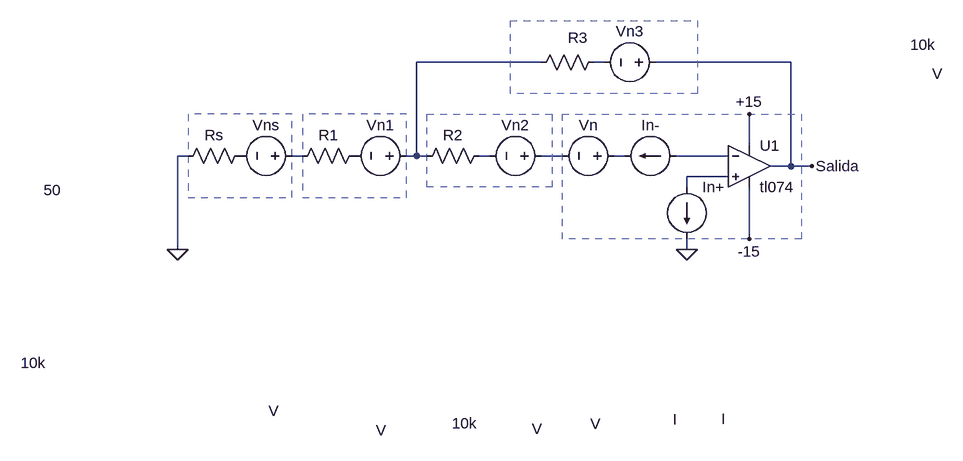
[diagram p0: schematic filtro modelo ruido.asc]
filtro modelo ruido.asc, the LTspice schematic file:
Version 4
SHEET 1 1620 680
WIRE -80 -464 -272 -464
WIRE 16 -464 0 -464
WIRE 304 -464 96 -464
WIRE 240 -336 240 -384
WIRE -624 -320 -640 -320
WIRE -448 -320 -464 -320
WIRE -272 -320 -272 -464
WIRE -272 -320 -288 -320
WIRE -256 -320 -272 -320
WIRE -160 -320 -176 -320
WIRE -48 -320 -80 -320
WIRE 48 -320 32 -320
WIRE 208 -320 128 -320
WIRE 304 -304 304 -464
WIRE 304 -304 272 -304
WIRE 336 -304 304 -304
WIRE 208 -288 144 -288
WIRE 144 -272 144 -288
WIRE 240 -192 240 -272
WIRE -640 -176 -640 -320
WIRE 144 -176 144 -192
WIRE 160 -176 144 -176
FLAG 240 -384 +15
FLAG 240 -192 -15
FLAG -640 -176 0
FLAG 336 -304 Salida
FLAG 144 -176 0
SYMBOL res -464 -304 R270
WINDOW 0 32 56 VTop 2
WINDOW 3 -287 -398 VBottom 2
SYMATTR InstName R1
SYMATTR Value 10k
SYMBOL res -272 -304 R270
WINDOW 0 32 56 VTop 2
WINDOW 3 -380 74 VBottom 2
SYMATTR InstName R2
SYMATTR Value 10k
SYMBOL res -96 -448 R270
WINDOW 0 38 72 VTop 2
WINDOW 3 59 603 VBottom 2
SYMATTR InstName R3
SYMATTR Value 10k
SYMBOL tl074\\tl074 240 -368 R0
SYMATTR InstName U1
SYMBOL res -528 -336 R90
WINDOW 0 0 56 VBottom 2
WINDOW 3 53 305 VTop 2
SYMATTR InstName Rs
SYMATTR Value 50
SYMBOL voltage -448 -320 R90
WINDOW 0 -32 56 VBottom 2
WINDOW 3 377 44 VTop 2
SYMATTR InstName Vns
SYMBOL voltage -272 -320 R90
WINDOW 0 -32 56 VBottom 2
WINDOW 3 407 55 VTop 2
SYMATTR InstName Vn1
SYMBOL voltage 112 -464 R90
WINDOW 0 -32 56 VBottom 2
WINDOW 3 2 -417 VTop 2
SYMATTR InstName Vn3
SYMBOL voltage -64 -320 R90
WINDOW 0 -32 56 VBottom 2
WINDOW 3 405 23 VTop 2
SYMATTR InstName Vn2
SYMBOL voltage 48 -320 R90
WINDOW 0 -32 56 VBottom 2
WINDOW 3 397 45 VTop 2
SYMATTR InstName Vn
SYMBOL current 128 -320 R90
WINDOW 0 -32 40 VBottom 2
WINDOW 3 390 2 VTop 2
SYMATTR InstName In-
SYMBOL current 144 -272 R0
WINDOW 3 53 357 Left 2
SYMATTR InstName In+
RECTANGLE Normal 320 -192 -48 -384 2
RECTANGLE Normal -64 -272 -256 -384 2
RECTANGLE Normal -448 -256 -288 -384 2
RECTANGLE Normal -624 -256 -464 -384 2
RECTANGLE Normal 160 -416 -128 -528 2

The netlist it stands for:
* filtro modelo ruido.asc
R1 N003 P001 10k
R2 N001 N004 10k
R3 N001 N002 10k
* U1: tl074 (symbol tl074\tl074 not available, pins judged from their places): In+=N008 In-=N007 V+=+15 V-=-15 OUT=Salida
Rs P002 0 50
Vns N003 P002 V
Vn1 N001 P001 V
Vn3 Salida N002 V
Vn2 N005 N004 V
Vn N006 N005 V
In- N007 N006 I
In+ N008 0 I
.backanno
.end